# EAGLE design 6ButtonSMD (EAGLE 9.6.2)
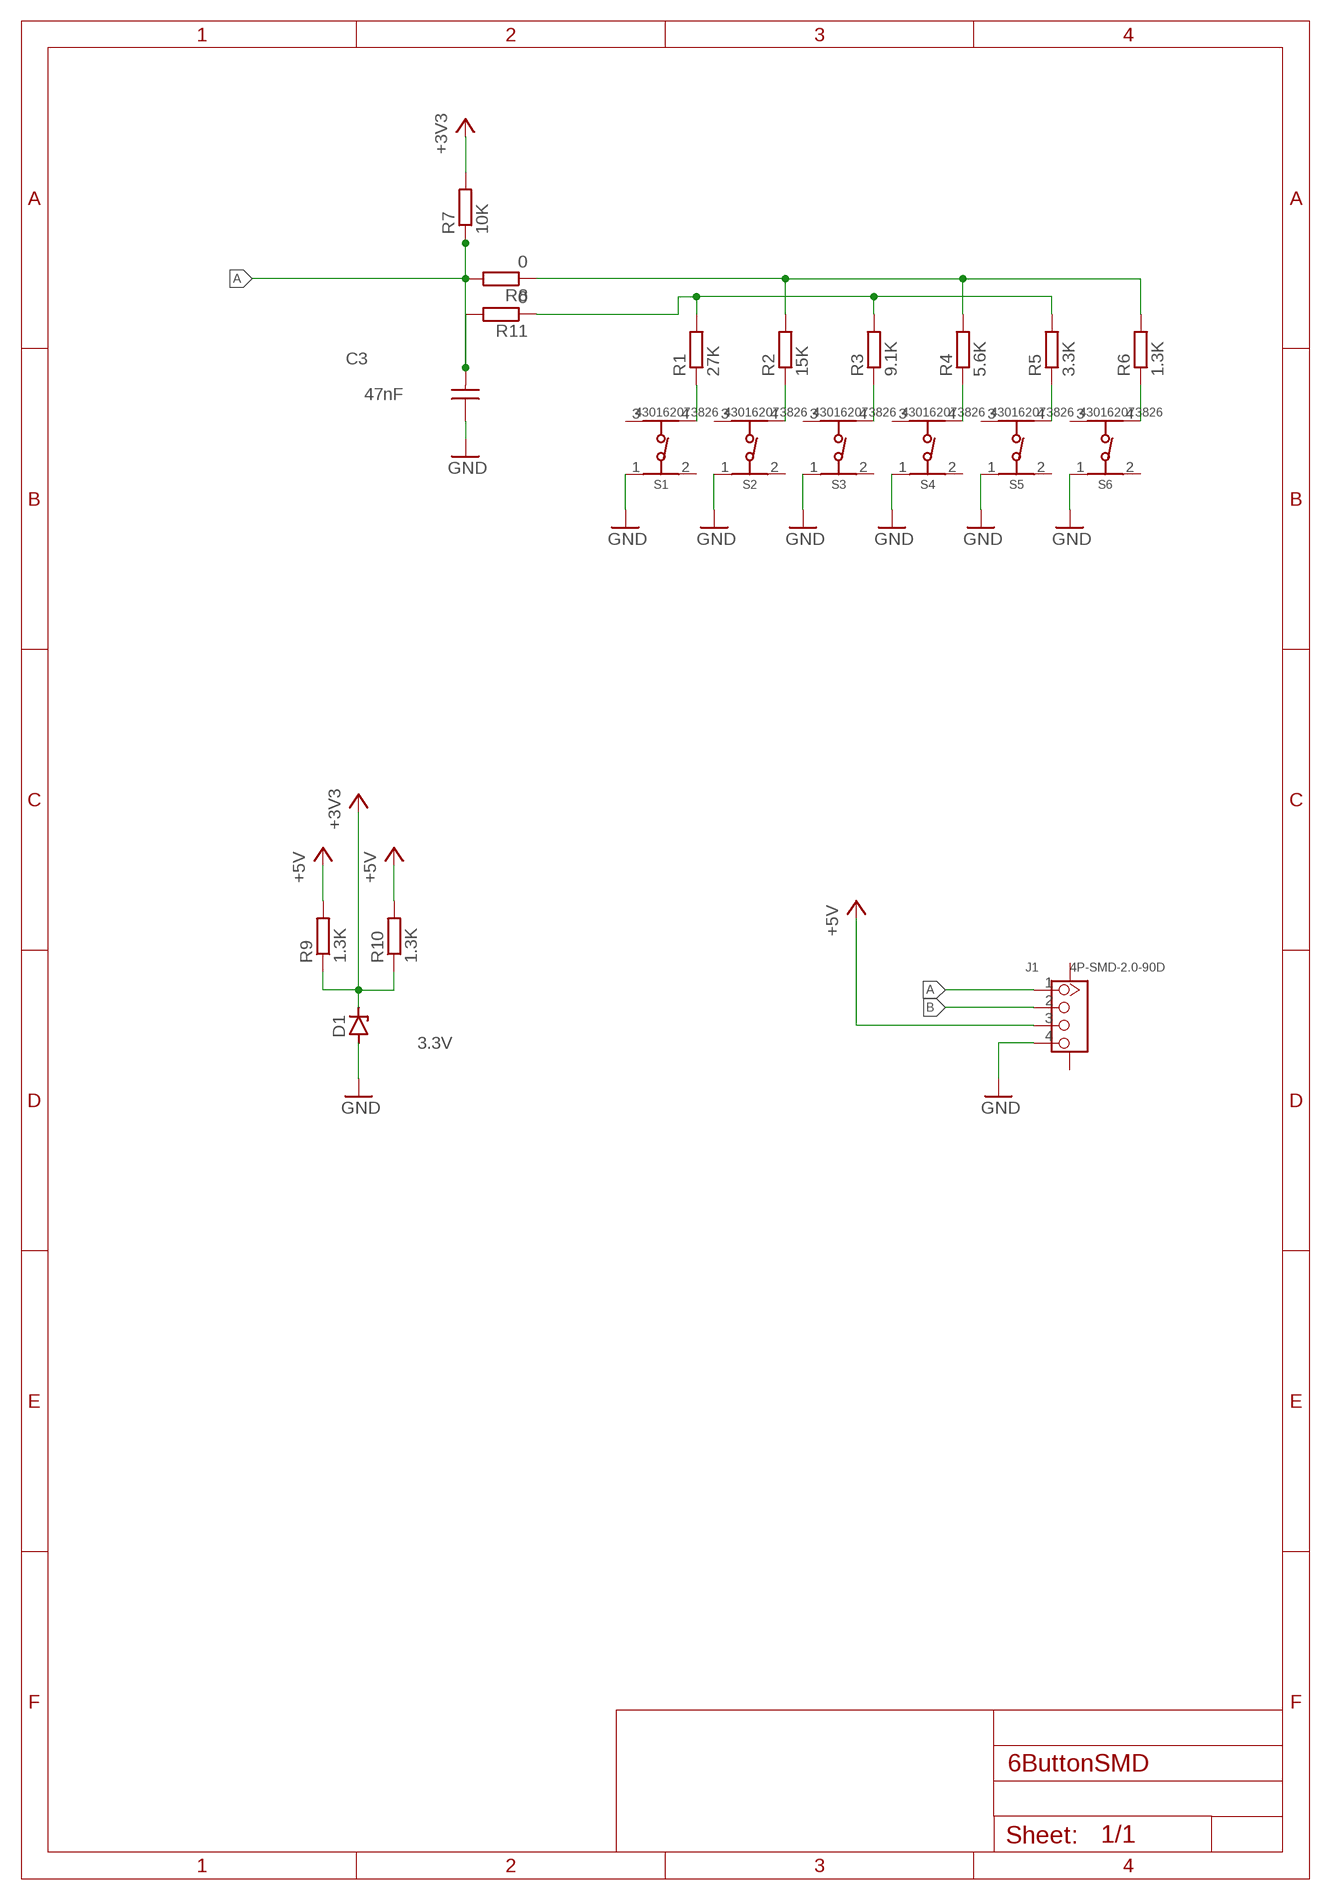
[diagram p0: schematic, sheet 1]

## Parts
C3  47nF  WCAP-CSGP_1206_H0.8_885012208085_50V(DC)  [WCAP-CSGP_1206_H0.8]
D1  3.3V  ZENER-DIODESOD80C  [SOD80C]
J1  4P-SMD-2.0-90D  GROVE-CONNECTOR-SMD-90D(4+2P-2.0)  [HW4-SMD-2.0-90D]
R1  27K  R-EU_R1206  [R1206]
R2  15K  R-EU_R1206  [R1206]
R3  9.1K  R-EU_R1206  [R1206]
R4  5.6K  R-EU_R1206  [R1206]
R5  3.3K  R-EU_R1206  [R1206]
R6  1.3K  R-EU_R1206  [R1206]
R7  10K  R-EU_R1206  [R1206]
R8  0  R-EU_R1206  [R1206]
R9  1.3K  R-EU_R1206  [R1206]
R10  1.3K  R-EU_R1206  [R1206]
R11  0  R-EU_R1206  [R1206]
S1  430162073826  [430162073826]
S2  430162073826  [430162073826]
S3  430162073826  [430162073826]
S4  430162073826  [430162073826]
S5  430162073826  [430162073826]
S6  430162073826  [430162073826]

## Nets
+3V3: D1.C R7.2 R9.1 R10.1
+5V: J1.3 R9.2 R10.2
A: C3.2 J1.1 R7.1 R8.2 R11.2
B: J1.2
GND: C3.1 D1.A J1.4 S1.1 S2.1 S3.1 S4.1 S5.1 S6.1
N$1: R1.1 S1.4
N$2: R2.1 S2.4
N$3: R3.1 S3.4
N$4: R4.1 S4.4
N$5: R5.1 S5.4
N$6: R6.1 S6.4
N$27: R2.2 R4.2 R6.2 R8.1
N$30: R1.2 R3.2 R5.2 R11.1
Unconnected: J1.SS1 J1.SS2 S1.2 S1.3 S2.2 S2.3 S3.2 S3.3 S4.2 S4.3 S5.2 S5.3 S6.2 S6.3

## Library data of the parts
C3 = Wurth_Capacitors_WCAP-CSGP:WCAP-CSGP_1206_H0.8: WCAP-CSGP MLCCs 1206 Characteristics General purpose product series High performance ceramic High electrical precision and stability ceramic especially for NP0 Minimal aging especially for NP0 Mounting style: SMT-Chip Ceramic: NP0 (Class I), X5R (Class II), X7R (Class II) Temperature coefficient: ±30 ppm/°C; ±0.54 % for NP0 ±15 % for X5R and X7R Operating temperature: -55 °C up to + 125 °C for NP0 and X7R -55 °C up to + 85 °C for X5R Termination: Cu/Ni/Sn Recommended soldering: Reflow soldering Wave soldering for size 0603 Wave soldering for size 0805 (only valid for the thickness ≤0.85 mm) Applications Temperature compensation (NP0) Coupling Decoupling Bypass Smoothing Filtering Resonant circuit <https://www.we-online.com/catalog/media/o177837v209%20MLCC_GRP_all.jpg> Details see: https://www.we-online.com/catalog/en/pbs/capacitors/multilayer_ceramic_chip_capacitors/mlcc_general_purpose Updated by yingchun,Shan;2020-03-09 2020(C) Würth Elektronik; CERAMIC-TYPE: X7R Class II; DATASHEET-URL: https://www.we-online.com/redexpert/spec/885012208085?ae; DF: 2.5%; HEIGHT: 0.8mm; MOUNT: SMT; OPERATING-TEMPERATURE: -55 up to +125 °C; PART-NUMBER: 885012208085; QMIN: -; RISO: 10GOhm; SIZE: 1206; TECHNICAL-REFERENCE: X7R1206473K050DFCT1000; VR: 50V(DC)
D1 = diode:ZENER-DIODE: Z-Diode
J1 = OPL_Connector:GROVE-CONNECTOR-SMD-90D(4+2P-2.0): 320110032
R1-R11 = rcl:R-EU_: RESISTOR, European symbol; SPICEPREFIX: R
S1-S6 = Wurth_Switch_WS-TASV:430162073826: WS-TASV SMT Tact Switch 12x12 mm Material Properties Cover Material : Stainless Steel Properties Actuator Material LCP Actuator Flammability Rating UL94 V-0 Actuator Color Black; White Frame Material PPA Frame Flammability Rating UL94 V-0 Frame Color Black Contact Material Stainless Steel Contact Plating Silver Terminal Material Copper Alloy Terminal Plating Silver VR 12 V (DC) Contact Resistance Initial 100 mΩ Contact Resistance After Life Test 2 Ω RISO 100 MΩ Withstanding Voltage 250 V (AC) Washable No Qty. 250; 400 Mechanical Properties Electrical Life:300000 Times; 500000 Times Stroke :0.3 mm General Information Operating Temperature:-40 up to +85 °C Washable:No Packaging Properties Packaging:Tape and Reel <https://www.we-online.com/catalog/media/o76676v209%20Family_WS-TASV-Gruppe.jpg> Details see: https://www.we-online.com/catalog/en/TASV_12X12_SMD/ Updated by yingchun,Shan;2020-02-20 2020(C) Würth Elektronik; DATASHEET-URL: https://www.we-online.com/redexpert/spec/430162073826?ae; H: 7.3mm; OPERATION-FORCE: 260g; PART-NUMBER: 430162073826; QTY: 250

## Board
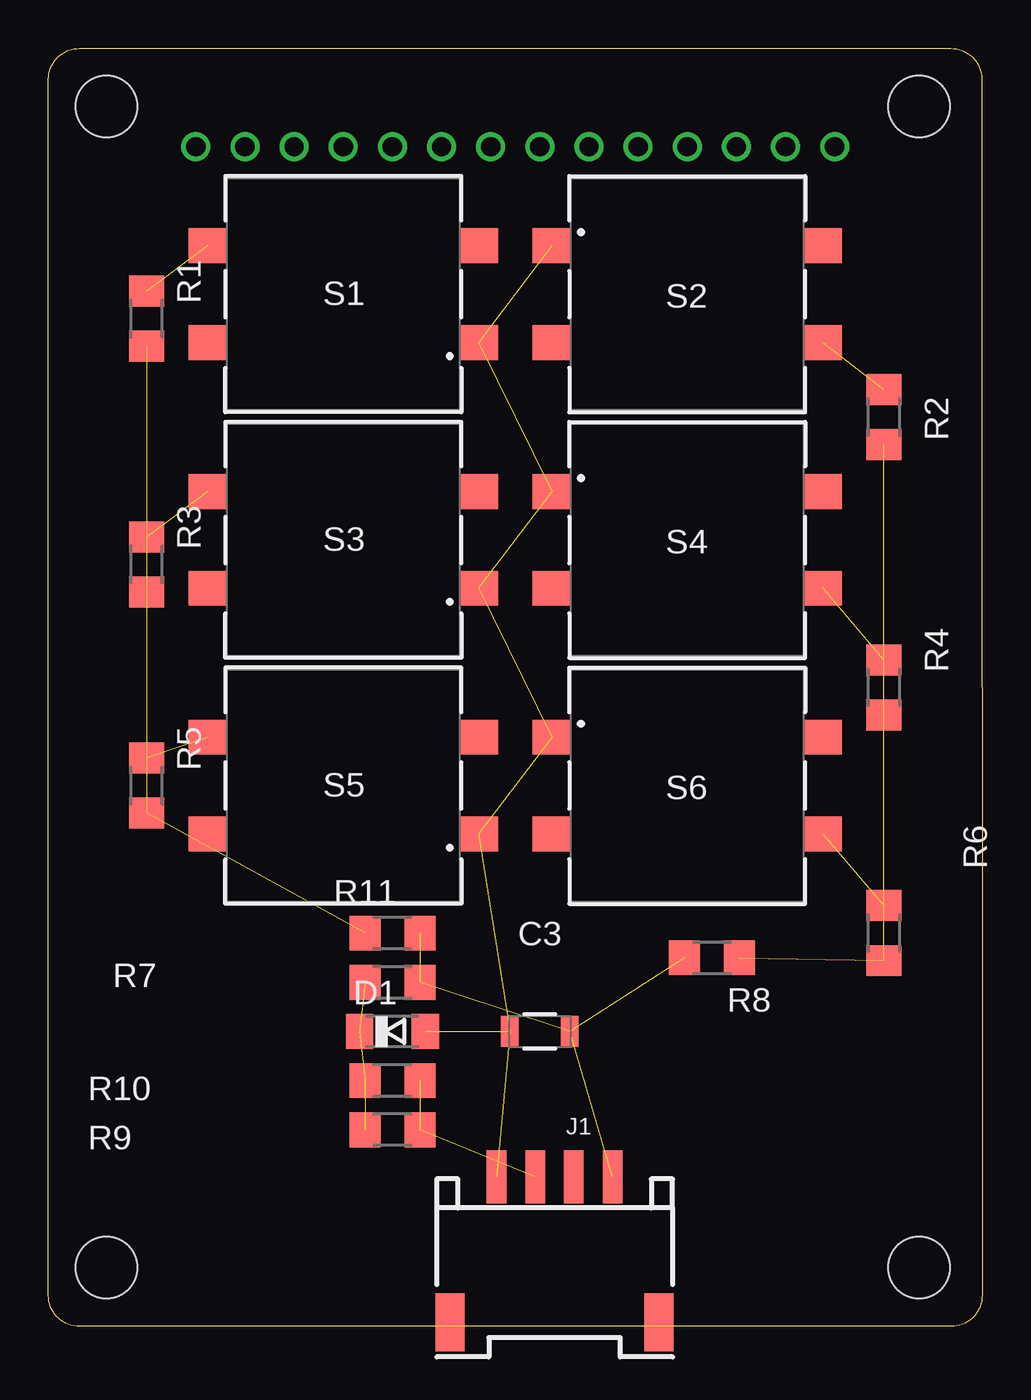
[diagram p1: board, top side]

Size 48.26 x 66.04 mm. Coordinates in mm from the lower left corner, seen from the top.
Outline: 0,1.6 0,64.44 arc-90 1.6,66.04 46.64,66.04 arc-90 48.24,64.44 48.26,1.6 arc-90 46.66,0 1.6,0 arc-90 0,1.6
Copper layers (1*16): Top 0.035mm / dielectric 1.5mm / Bottom 0.035mm
Design rules "default": minimum track width 6mil, minimum drill 0.35mm, track to track 6mil, track to pad 6mil, pad to pad 6mil, via to via 6mil, smd to smd 6mil, copper to edge 40mil, drill to drill 6mil, minimum pad ring 10mil, minimum via ring 8mil, stop-mask expansion 4mil, vias tented up to drill 0mil, thermal gap 10mil
Holes 3.2 mm at 3,63.04 45,63.04 45,3.04 3,3.04

### Footprints (pad centres in the part's own frame; a part is rotated, then mirrored left to right if it is on the bottom)
WCAP-CSGP_1206_H0.8 = smd 0.9 x 1.6: 1 -1.55,0; 2 1.55,0
SOD80C = smd 1.4 x 1.8: A 1.7,0; C -1.7,0
HW4-SMD-2.0-90D = smd 1.01 x 2.74: 1 -3,-0.1; 2 -1,-0.1; 3 1,-0.1; 4 3,-0.1 | smd 1.5 x 3: SS1 -5.4,7.4; SS2 5.4,7.4
R1206 = smd 1.6 x 1.803: 1 -1.422,0; 2 1.422,0
430162073826 = smd 2 x 1.8: 1 -7,2.5; 2 7,2.5; 3 -7,-2.5; 4 7,-2.5

### Placement (x,y rotation side)
C3  25.4,15.24 0 top
D1  17.78,15.24 0 top
J1  26.16,7.62 180 top
R1  5.08,52.07 270 top
R2  43.18,46.99 270 top
R3  5.08,39.37 270 top
R4  43.18,33.02 270 top
R5  5.08,27.94 270 top
R6  43.18,20.32 270 top
R7  17.78,17.78 180 top
R8  34.29,19.05 180 top
R9  17.78,10.16 0 top
R10  17.78,12.7 0 top
R11  17.78,20.32 0 top
S1  15.24,53.34 180 top
S2  33.02,53.34 0 top
S3  15.24,40.64 180 top
S4  33.02,40.64 0 top
S5  15.24,27.94 180 top
S6  33.02,27.94 0 top

### Tracks (layer width: path | path; a pad name or v marks a point on that pad's centre or on a via)
+3V3  (3 unrouted)
+5V  (2 unrouted)
A  (4 unrouted)
GND  (8 unrouted)
N$1  (1 unrouted)
N$2  (1 unrouted)
N$3  (1 unrouted)
N$4  (1 unrouted)
N$5  (1 unrouted)
N$6  (1 unrouted)
N$11  (via drill 1)
  other vias: 7.62,60.96
N$12  (via drill 1)
  other vias: 10.16,60.96
N$13  (via drill 1)
  other vias: 12.7,60.96
N$14  (via drill 1)
  other vias: 15.24,60.96
N$15  (via drill 1)
  other vias: 17.78,60.96
N$16  (via drill 1)
  other vias: 20.32,60.96
N$17  (via drill 1)
  other vias: 22.86,60.96
N$18  (via drill 1)
  other vias: 25.4,60.96
N$19  (via drill 1)
  other vias: 27.94,60.96
N$20  (via drill 1)
  other vias: 30.48,60.96
N$21  (via drill 1)
  other vias: 33.02,60.96
N$22  (via drill 1)
  other vias: 35.56,60.96
N$23  (via drill 1)
  other vias: 38.1,60.96
N$24  (via drill 1)
  other vias: 40.64,60.96
N$27  (3 unrouted)
N$30  (3 unrouted)